# EAGLE design SD2SP2 v1p2b (EAGLE 9.6.2)
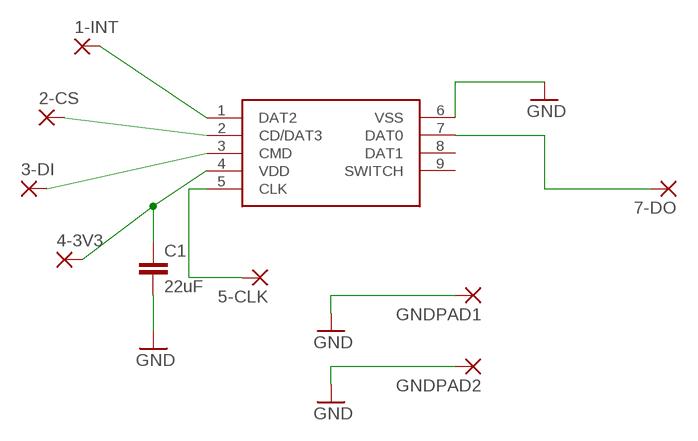
[diagram p0: schematic, sheet 1]

## Parts
1-INT  PADSRECTANGLE-1,5X7  [RECTANGLE-1,5X7]
2-CS  PADSRECTANGLE-1,5X7  [RECTANGLE-1,5X7]
3-DI  PADSRECTANGLE-1,5X7  [RECTANGLE-1,5X7]
4-3V3  PADSRECTANGLE-1,5X7  [RECTANGLE-1,5X7]
5-CLK  PADSRECTANGLE-1,5X7  [RECTANGLE-1,5X7]
7-DO  PADSRECTANGLE-1,5X7  [RECTANGLE-1,5X7]
C1  22uF  CAPACITORSC1206  [C1206]
GNDPAD1  PADSRECTANGLE-1,5X7  [RECTANGLE-1,5X7]
GNDPAD2  PADSRECTANGLE-1,5X7  [RECTANGLE-1,5X7]
J1  SD-CARD-CONNECTOR  [105027-0001]

## Nets
GND: C1.2 GNDPAD1.1(P) GNDPAD2.1(P) J1.6(VSS)
N$1: 4-3V3.1(P) C1.1 J1.4(VDD)
N$2: 1-INT.1(P) J1.1(DAT2)
N$3: 2-CS.1(P) J1.2(CD/DAT3)
N$4: 3-DI.1(P) J1.3(CMD)
N$5: 5-CLK.1(P) J1.5(CLK)
N$6: 7-DO.1(P) J1.7(DAT0)
Unconnected: J1.8(DAT1) J1.9(SWITCH)

## Library data of the parts
1-INT 2-CS 3-DI 4-3V3 5-CLK 7-DO GNDPAD1 GNDPAD2 = Consoles Unleashed Eagle Parts Library:PADS: PADS to connect wires to PCB
C1 = Consoles Unleashed Eagle Parts Library:CAPACITORS: Capacitors
J1 = Consoles Unleashed Eagle Parts Library:SD-CARD-CONNECTOR: SD Micro Memory Card Connector; DESCRIPTION: Memory Card Connectors ASSY FOR 1.70H TFR HEADER; HEIGHT: mm; MANUFACTURER_NAME: Molex; MANUFACTURER_PART_NUMBER: 105027-0001; MOUSER_PART_NUMBER: 538-105027-0001; MOUSER_PRICE-STOCK: https://www.mouser.co.uk/ProductDetail/Molex/105027-0001?qs=39WuQm6e6OkSeL34qdqRiA%3D%3D

## Board
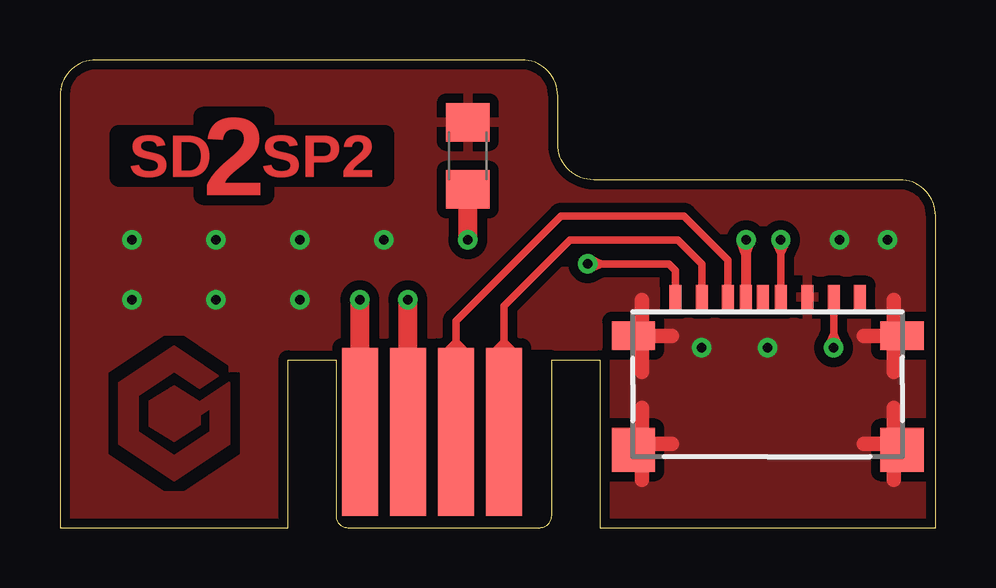
[diagram p1: board, top side]
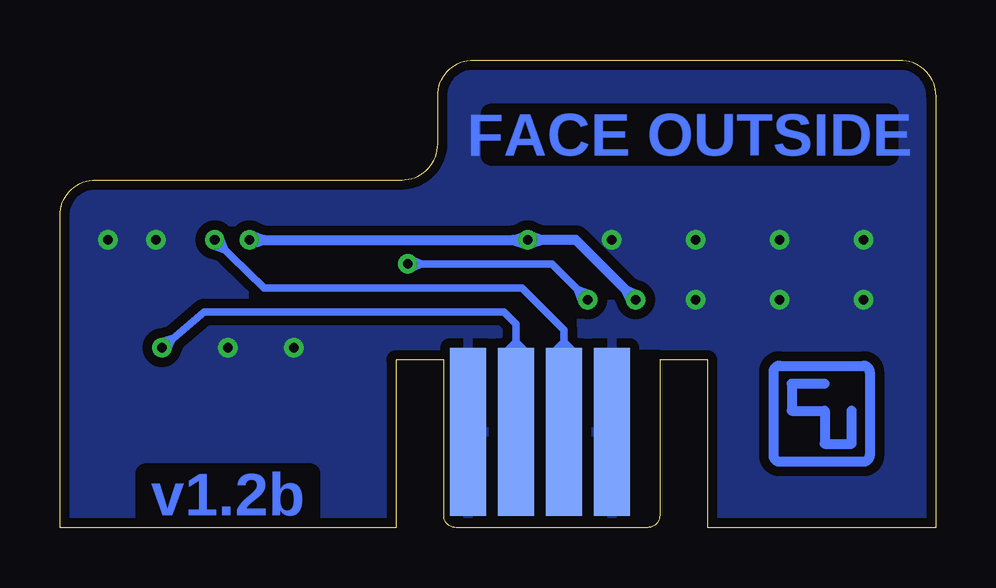
[diagram p2: board, bottom side, seen from below]

Size 36.5 x 19.5 mm. Coordinates in mm from the lower left corner, seen from the top.
Outline: 0,0 9.5,0 9.5,7 11.5,7 11.5,0.5 arc90 12,0 20,0 arc90 20.5,0.5 20.5,7 22.5,7 22.5,0 36.5,0 36.5,13 arc90 35,14.5 22.25,14.5 arc-90 20.75,16 20.75,18 arc90 19.25,19.5 1.5,19.5 arc90 0,18 0,0
Copper layers (1*16): Top 0.035559375mm / dielectric 1.6mm / Bottom 0.035559375mm
Design rules "oshpark-2layer *": minimum track width 6mil, minimum drill 10mil, track to track 6mil, track to pad 6mil, pad to pad 6mil, via to via 6mil, smd to smd 6mil, copper to edge 15mil, drill to drill 6mil, minimum pad ring 5mil, minimum via ring 5mil, stop-mask expansion 2.5mil, vias tented up to drill 1mm, thermal gap 0.4mm

### Footprints (pad centres in the part's own frame; a part is rotated, then mirrored left to right if it is on the bottom)
RECTANGLE-1,5X7 = smd 1.5 x 7: 1 0,0
C1206 = smd 1.6 x 1.8: 1 -1.4,0; 2 1.4,0
105027-0001 = smd 0.5 x 1: 1 3.85,-1.61; 2 2.75,-1.61; 3 1.65,-1.61; 4 0.9,-1.61; 5 -0.55,-1.61; 6 -1.65,-1.61; 7 -2.75,-1.61; 8 -3.85,-1.61; 9 0.2,-1.61 | smd 1.05 x 1.2: 10 -5.225,4.45; 11 5.225,4.45; 12 -5.225,0; 13 5.225,0; 14 -5.975,0; 15 5.975,0; 16 -5.975,4.45; 17 5.975,4.45; 18 -5.975,5.075; 19 -5.225,5.075; 20 5.225,5.075; 21 5.975,5.075

### Placement (x,y rotation side)
1-INT  14.5,4 0 top
2-CS  18.5,4 0 top
3-DI  16.5,4 0 top
4-3V3  12.5,4 0 top
5-CLK  15.5,4 0 bottom
7-DO  17.5,4 0 bottom
C1  17,15.5 90 top
GNDPAD1  13.5,4 0 bottom
GNDPAD2  19.5,4 0 bottom
J1  29.5,8 180 top

### Tracks (layer width: path | path; a pad name or v marks a point on that pad's centre or on a via)
AVOID1
  cutout Bottom: 11.5,7.4 13,7.4 13,0 11.5,0
AVOID2
  cutout Top: 19,7.4 20.5,7.4 20.5,0 19,0
GC-LOGO
  pour Top: 4.76,1.96 2.47,3.48 2.47,6.02 4.76,7.55 6.56,6.33 5.82,5.83 4.76,6.53 3.23,5.52 3.23,3.99 4.76,2.98 6.28,3.99 6.28,5.01 5.81,4.69 5.81,4.29 4.77,3.62 3.74,4.25 3.74,5.26 4.75,5.9 5.82,5.22 7.04,6.02 7.04,3.48
GND  (via drill 0.4 pad 0.8)
  Top 0.61: 24.25,9.5 24.25,8 | 24.25,8 24.25,6.5 | 24.25,5 24.25,3.5 | 24.25,3.5 24.25,2 | 34.75,5 34.75,3.5 | 34.75,3.5 34.75,2 | 34.75,9.5 34.75,8 | 34.75,8 34.75,6.5 | 24.25,3.5 25.5,3.5 | 24.25,8 25.5,8 | 34.75,8 33.5,8 | 34.75,3.5 33.5,3.5
  other vias: 3,9.5 6.5,9.5 10,9.5 34.5,12 6.5,12 32.5,12 3,12 10,12 26.75,7.5 29.5,7.5 13.5,12
  pour Top (isolate 0.4, rank 2): 0,0 0,18 arc-90 1.5,19.5 19.25,19.5 arc-90 20.75,18 20.75,16 arc90 22.25,14.5 35,14.5 arc-90 36.5,13 36.5,0 22.5,0 22.5,7 20.5,7 20.5,0 11.5,0 11.5,7 9.5,7 9.5,0
  pour Bottom (isolate 0.4): 0,0 0,18 arc-90 1.5,19.5 19.25,19.5 arc-90 20.75,18 20.75,16 arc90 22.25,14.5 35,14.5 arc-90 36.5,13 36.5,0 22.5,0 22.5,7 20.5,7 20.5,0 11.5,0 11.5,7 9.5,7 9.5,0
LOGO
  Bottom 0.406: 4.62,6 6,6 6,4.88 4.62,4.88 4.62,3.5 3.5,3.5 3.5,4.88 | 2.75,6.5 2.75,3 arc90 3,2.75 6.5,2.75 arc90 6.75,3 6.75,6.5 arc90 6.5,6.75 3,6.75 arc90 2.75,6.5
N$1  (via drill 0.4 pad 0.8)
  Top 0.305: v28.6,12 28.6,11.9
  Top 0.406: 28.6,11.9 J1.4 | 28.6,11.4 28.79,11.94 v28.6,12 28.41,11.94 28.6,11.4
  Top 0.8: 4-3V3.1 v12.5,9.5 | v17,12 C1.1
  Bottom 0.406: v12.5,9.5 15,12 v17,12 | v28.6,12 v17,12 | v12.5,9.5 12.41,9.68 12.92,9.92 12.68,9.41 v12.5,9.5 | v17,12 16.93,11.81 16.4,12 16.93,12.19 v17,12 | v17,12 17.07,12.19 17.6,12 17.07,11.81 v17,12 | v28.6,12 28.54,11.81 28,12 28.54,12.19 v28.6,12
N$2  (via drill 0.4 pad 0.8)
  Top 0.305: v22,11 25.38,11 25.65,10.72 J1.1 | v22,11 22.1,11.23 22.6,11 22.1,10.77 v22,11
  Top 0.8: 1-INT.1 v14.5,9.5
  Bottom 0.305: v22,11 16,11 v14.5,9.5 | v14.5,9.5 14.41,9.73 14.92,9.92 14.73,9.41 v14.5,9.5 | v22,11 21.9,10.77 21.4,11 21.9,11.23 v22,11
N$3
  Top 0.305: 2-CS.1 18.5,7.75 | 18.5,7.75 18.5,9.25 21.25,12 25.75,12 26.75,11 J1.2 | 19,7.25 18.5,7.75 | 18.5,7.75 18,7.25
N$4
  Top 0.305: 3-DI.1 16.5,7.75 | 16.5,7.75 16.5,8.62 20.88,13 26,13 27.85,11.15 J1.3 | 17,7.25 16.5,7.75 | 16.5,7.75 16,7.25
N$5  (via drill 0.4 pad 0.8)
  Top 0.305: J1.5 v30.05,12 | v30.05,12 30.28,11.9 30.05,11.4 29.82,11.9 v30.05,12
  Bottom 0.305: v30.05,12 28,10 17.25,10 15.5,8.25 15.5,7.75 | 5-CLK.1 15.5,7.75 | 16,7.25 15.5,7.75 | 15.5,7.75 15,7.25 | v30.05,12 30.13,11.77 29.62,11.58 29.82,12.09 v30.05,12
N$6  (via drill 0.4 pad 0.8)
  Top 0.305: v32.25,7.5 J1.7 | v32.25,7.5 32.02,7.6 32.25,8.1 32.48,7.6 v32.25,7.5
  Bottom 0.305: 7-DO.1 17.5,7.75 | 17.5,7.75 17.5,8.5 18,9 30.5,9 v32.25,7.5 | 18,7.25 17.5,7.75 | 17.5,7.75 17,7.25 | v32.25,7.5 32.03,7.39 31.79,7.89 32.32,7.74 v32.25,7.5

### Text on the board
Top: 2 | SD SP2
Bottom: FACE OUTSIDE | v1.2b